# Altium schematic sheet IO.SchDoc
size A4
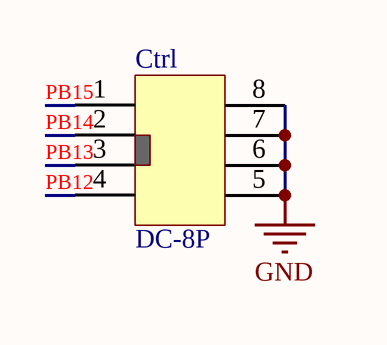
[diagram p0: IO.SchDoc]

## Parts
Ctrl  DC-8P  [DC-8P]

## Nets
GND: Ctrl.5 Ctrl.6 Ctrl.7 Ctrl.8
PB12: Ctrl.4
PB13: Ctrl.3
PB14: Ctrl.2
PB15: Ctrl.1